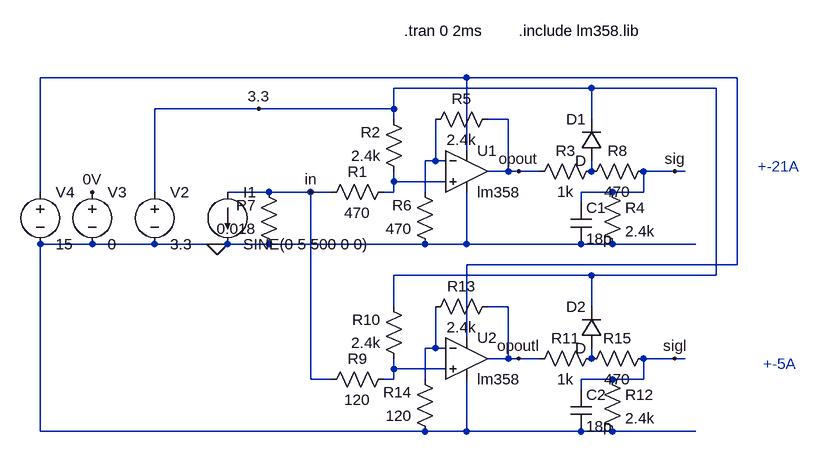
[diagram p0: schematic strom.asc]
strom.asc, the LTspice schematic file:
Version 4
SHEET 1 952 728
WIRE 416 176 -240 176
WIRE 832 176 416 176
WIRE 608 192 304 192
WIRE 800 192 608 192
WIRE 96 224 -64 224
WIRE 304 224 304 192
WIRE 304 224 96 224
WIRE 304 240 304 224
WIRE 480 240 448 240
WIRE 608 240 608 192
WIRE 416 288 416 176
WIRE 368 304 368 240
WIRE 368 304 352 304
WIRE 384 304 368 304
WIRE 480 320 480 240
WIRE 480 320 448 320
WIRE 496 320 480 320
WIRE 528 320 496 320
WIRE 608 320 608 304
WIRE 736 320 688 320
WIRE 752 320 736 320
WIRE 304 336 304 320
WIRE 384 336 304 336
WIRE -240 352 -240 176
WIRE -64 352 -64 224
WIRE 112 352 48 352
WIRE 176 352 112 352
WIRE 208 352 176 352
WIRE 304 352 304 336
WIRE 304 352 288 352
WIRE 352 352 352 304
WIRE 640 352 592 352
WIRE 688 352 688 320
WIRE 688 352 640 352
WIRE 592 368 592 352
WIRE -160 432 -240 432
WIRE -64 432 -160 432
WIRE 32 432 -64 432
WIRE 48 432 32 432
WIRE 112 432 48 432
WIRE 352 432 112 432
WIRE 416 432 416 352
WIRE 416 432 352 432
WIRE 592 432 416 432
WIRE 640 432 592 432
WIRE 768 432 640 432
WIRE 832 464 832 176
WIRE 832 464 416 464
WIRE 608 480 304 480
WIRE 800 480 800 192
WIRE 800 480 608 480
WIRE 304 528 304 480
WIRE 480 528 448 528
WIRE 608 528 608 480
WIRE 416 576 416 464
WIRE 368 592 368 528
WIRE 368 592 352 592
WIRE 384 592 368 592
WIRE 480 608 480 528
WIRE 480 608 448 608
WIRE 496 608 480 608
WIRE 528 608 496 608
WIRE 608 608 608 592
WIRE 736 608 688 608
WIRE 752 608 736 608
WIRE 304 624 304 608
WIRE 384 624 304 624
WIRE 176 640 176 352
WIRE 208 640 176 640
WIRE 304 640 304 624
WIRE 304 640 288 640
WIRE 352 640 352 592
WIRE 640 640 592 640
WIRE 688 640 688 608
WIRE 688 640 640 640
WIRE 592 656 592 640
WIRE -240 720 -240 432
WIRE 352 720 -240 720
WIRE 416 720 416 640
WIRE 416 720 352 720
WIRE 592 720 416 720
WIRE 640 720 592 720
WIRE 768 720 640 720
FLAG 32 432 0
FLAG 496 320 opout
FLAG 176 352 in
FLAG 96 224 3.3
FLAG -160 352 0V
FLAG 736 320 sig
FLAG 496 608 opoutl
FLAG 736 608 sigl
SYMBOL res 304 336 R90
WINDOW 0 0 56 VBottom 2
WINDOW 3 32 56 VTop 2
SYMATTR InstName R1
SYMATTR Value 470
SYMBOL res 320 336 R180
WINDOW 0 36 76 Left 2
WINDOW 3 36 40 Left 2
SYMATTR InstName R2
SYMATTR Value 2.4k
SYMBOL voltage -64 336 R0
SYMATTR InstName V2
SYMATTR Value 3.3
SYMBOL voltage -160 336 R0
SYMATTR InstName V3
SYMATTR Value 0
SYMBOL voltage -240 336 R0
SYMATTR InstName V4
SYMATTR Value 15
SYMBOL res 512 336 R270
WINDOW 0 32 56 VTop 2
WINDOW 3 0 56 VBottom 2
SYMATTR InstName R3
SYMATTR Value 1k
SYMBOL res 624 336 R0
SYMATTR InstName R4
SYMATTR Value 2.4k
SYMBOL res 352 256 R270
WINDOW 0 32 56 VTop 2
WINDOW 3 0 56 VBottom 2
SYMATTR InstName R5
SYMATTR Value 2.4k
SYMBOL res 368 448 R180
WINDOW 0 36 76 Left 2
WINDOW 3 36 40 Left 2
SYMATTR InstName R6
SYMATTR Value 470
SYMBOL Opamps/opamp2 416 256 R0
SYMATTR InstName U1
SYMATTR Value lm358
SYMBOL cap 576 368 R0
SYMATTR InstName C1
SYMATTR Value 18p
SYMBOL current 48 352 R0
SYMATTR InstName I1
SYMATTR Value SINE(0 5 500 0 0)
SYMBOL res 128 448 R180
WINDOW 0 36 76 Left 2
WINDOW 3 36 40 Left 2
SYMATTR InstName R7
SYMATTR Value 0.018
SYMBOL res 592 336 R270
WINDOW 0 32 56 VTop 2
WINDOW 3 0 56 VBottom 2
SYMATTR InstName R8
SYMATTR Value 470
SYMBOL diode 624 304 R180
WINDOW 0 24 64 Left 2
WINDOW 3 24 0 Left 2
SYMATTR InstName D1
SYMBOL res 304 624 R90
WINDOW 0 0 56 VBottom 2
WINDOW 3 32 56 VTop 2
SYMATTR InstName R9
SYMATTR Value 120
SYMBOL res 320 624 R180
WINDOW 0 36 76 Left 2
WINDOW 3 36 40 Left 2
SYMATTR InstName R10
SYMATTR Value 2.4k
SYMBOL res 512 624 R270
WINDOW 0 32 56 VTop 2
WINDOW 3 0 56 VBottom 2
SYMATTR InstName R11
SYMATTR Value 1k
SYMBOL res 624 624 R0
SYMATTR InstName R12
SYMATTR Value 2.4k
SYMBOL res 352 544 R270
WINDOW 0 32 56 VTop 2
WINDOW 3 0 56 VBottom 2
SYMATTR InstName R13
SYMATTR Value 2.4k
SYMBOL res 368 736 R180
WINDOW 0 36 76 Left 2
WINDOW 3 36 40 Left 2
SYMATTR InstName R14
SYMATTR Value 120
SYMBOL Opamps/opamp2 416 544 R0
SYMATTR InstName U2
SYMATTR Value lm358
SYMBOL cap 576 656 R0
SYMATTR InstName C2
SYMATTR Value 18p
SYMBOL res 592 624 R270
WINDOW 0 32 56 VTop 2
WINDOW 3 0 56 VBottom 2
SYMATTR InstName R15
SYMATTR Value 470
SYMBOL diode 624 592 R180
WINDOW 0 24 64 Left 2
WINDOW 3 24 0 Left 2
SYMATTR InstName D2
TEXT 320 104 Left 2 !.tran 0 2ms
TEXT 496 104 Left 2 !.include lm358.lib
TEXT 864 312 Left 2 ;+-21A
TEXT 872 616 Left 2 ;+-5A

The netlist it stands for:
* strom.asc
R1 N004 in 470
R2 N004 3.3 2.4k
V2 3.3 0 3.3
V3 0V 0 0
V4 N001 0 15
R3 opout N003 1k
R4 sig 0 2.4k
R5 N002 opout 2.4k
R6 0 N002 470
XU1 N004 N002 N001 0 opout lm358  ; pins In+ In- V+ V- OUT
C1 sig 0 18p
I1 in 0 SINE(0 5 500 0 0)
R7 0 in 0.018
R8 N003 sig 470
D1 N003 3.3 D
R9 N007 in 120
R10 N007 3.3 2.4k
R11 opoutl N006 1k
R12 sigl 0 2.4k
R13 N005 opoutl 2.4k
R14 0 N005 120
XU2 N007 N005 N001 0 opoutl lm358  ; pins In+ In- V+ V- OUT
C2 sigl 0 18p
R15 N006 sigl 470
D2 N006 3.3 D
.model D D
.lib standard.dio
.tran 0 2ms
.include lm358.lib
* +-21A
* +-5A
.backanno
.end